# EAGLE design aspirin (EAGLE 6.1)
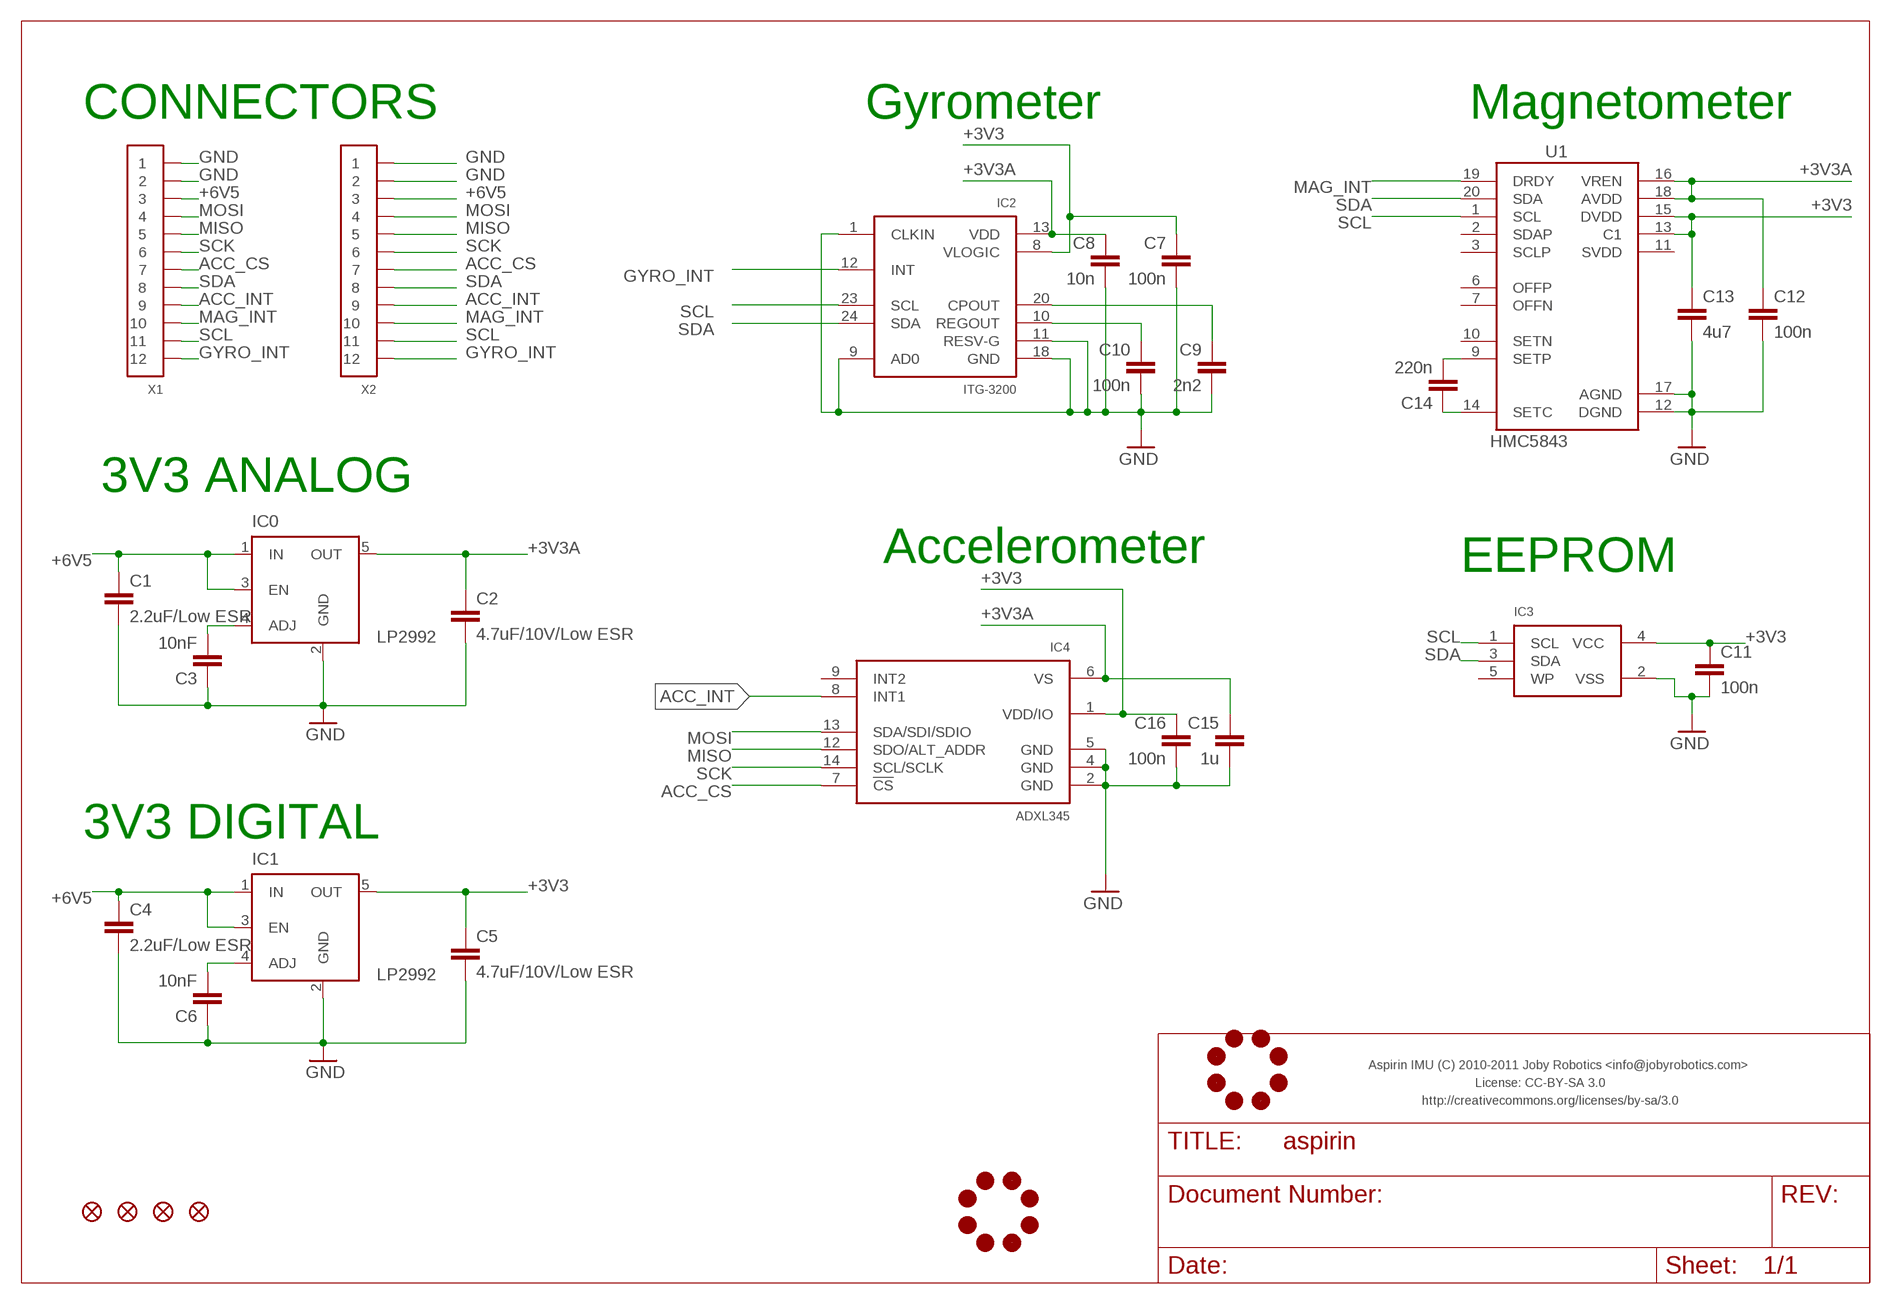
[diagram p0: schematic, sheet 1]

## Parts
C1  2.2uF/Low ESR  CAPACITOR-0603  [0603-CAP]
C2  4.7uF/10V/Low ESR  CAPACITOR-0603  [0603-CAP]
C3  10nF  CAPACITOR-0603  [0603-CAP]
C4  2.2uF/Low ESR  CAPACITOR-0603  [0603-CAP]
C5  4.7uF/10V/Low ESR  CAPACITOR-0603  [0603-CAP]
C6  10nF  CAPACITOR-0603  [0603-CAP]
C7  100n  CAPACITOR-0603  [0603-CAP]
C8  10n  CAPACITOR-0603  [0603-CAP]
C9  2n2  CAPACITOR-0603  [0603-CAP]
C10  100n  CAPACITOR-0603  [0603-CAP]
C11  100n  CAPACITOR-0603  [0603-CAP]
C12  100n  CAPACITOR-0603  [0603-CAP]
C13  4u7  CAPACITOR-0603  [0603-CAP]
C14  220n  CAPACITOR-0603  [0603-CAP]
C15  1u  CAPACITOR-0603  [0603-CAP]
C16  100n  CAPACITOR-0603  [0603-CAP]
IC0  LP2992  MIC5219BM5  [SOT23-5]
IC1  LP2992  MIC5219BM5  [SOT23-5]
IC2  ITG-3200  ITG-3200-AX  [QFN24-WITH-AXES]
IC3  I2C_EEPROM-SOT23-5  [SOT23-5]
IC4  ADXL345  [LGA-14]
JL1  JOBY_LOGO-6MIL  [JOBY_LOGO_6MIL]
JL2  JOBY_LOGO-6MIL  [JOBY_LOGO_6MIL]
JP1  FIDUCIAL1X2  [FIDUCIAL-1X2]
JP2  FIDUCIAL1X2  [FIDUCIAL-1X2]
JP3  FIDUCIAL1X2  [FIDUCIAL-1X2]
JP4  FIDUCIAL1X2  [FIDUCIAL-1X2]
U1  HMC5843  [LPCC20-HMC5843]
X1  CONN_12-1-53047  [PB-53047-12]
X2  CONN_12-1-53261  [PB-53261-12]

## Nets
+3V3: C5.P$1 C7.P$1 C11.P$1 C13.P$1 C16.P$1 IC1.5(OUT) IC2.8(VLOGIC) IC3.4(VCC) IC4.1(VDD/IO) U1.13(C1) U1.15(DVDD)
+3V3A: C2.P$1 C8.P$1 C12.P$1 C15.P$1 IC0.5(OUT) IC2.13(VDD) IC4.6(VS) U1.16(VREN) U1.18(AVDD)
+6V5: C1.P$1 C4.P$1 IC0.1(IN) IC0.3(EN) IC1.1(IN) IC1.3(EN) X1.3 X2.3
ACC_CS: IC4.7(!CS) X1.7 X2.7
ACC_INT: IC4.8(INT1) X1.9 X2.9
GND: C1.P$2 C2.P$2 C3.P$1 C4.P$2 C5.P$2 C6.P$1 C7.P$2 C8.P$2 C9.P$2 C10.P$2 C11.P$2 C12.P$2 C13.P$2 C15.P$2 C16.P$2 IC0.2(GND) IC1.2(GND) IC2.1(CLKIN) IC2.9(AD0) IC2.11(RESV-G) IC2.18(GND) IC3.2(VSS) IC4.2(GND) IC4.4(GND) IC4.5(GND) U1.12(DGND) U1.17(AGND) X1.1 X1.2 X2.1 X2.2
GYRO_INT: IC2.12(INT) X1.12 X2.12
MAG_INT: U1.19(DRDY) X1.10 X2.10
MISO: IC4.12(SDO/ALT_ADDR) X1.5 X2.5
MOSI: IC4.13(SDA/SDI/SDIO) X1.4 X2.4
N$1: C9.P$1 IC2.20(CPOUT)
N$2: C10.P$1 IC2.10(REGOUT)
N$19: C6.P$2 IC1.4(ADJ)
N$23: C3.P$2 IC0.4(ADJ)
N$34: C14.P$2 U1.9(SETP)
N$48: C14.P$1 U1.14(SETC)
SCK: IC4.14(SCL/SCLK) X1.6 X2.6
SCL: IC2.23(SCL) IC3.1(SCL) U1.1(SCL) X1.11 X2.11
SDA: IC2.24(SDA) IC3.3(SDA) U1.20(SDA) X1.8 X2.8
Unconnected: IC3.5(WP) IC4.9(INT2) U1.2(SDAP) U1.3(SCLP) U1.6(OFFP) U1.7(OFFN) U1.10(SETN) U1.11(SVDD)

## Notes on the sheet
- CONNECTORS | Gyrometer | Magnetometer
- 3V3 ANALOG
- Accelerometer | EEPROM
- 3V3 DIGITAL
- Aspirin IMU (C) 2010-2011 Joby Robotics <info@jobyrobotics.com>
- License: CC-BY-SA 3.0
- http://creativecommons.org/licenses/by-sa/3.0

## Library data of the parts
C1-C16 = pel_dipol_comp:CAPACITOR
IC0 IC1 = v-reg-micrel:MIC5219BM5: VOLTAGE REGULATOR
IC2 = aspirin:ITG-3200
IC3 = aspirin:I2C_EEPROM
IC4 = aspirin:ADXL345
JL1 JL2 = aspirin:JOBY_LOGO
JP1-JP4 = aspirin:FIDUCIAL: Fiducial Alignment Points Various fiducial points for machine vision alignment.
U1 = aspirin:HMC5843: Honeywell HMC5843 - 3-Axis Digital Magnetometer - 3-Axis Magnetoresistive Sensors and ASIC in a Single Package - Low Voltage Operations (2.5 to 3.3V) - I2C Interface
X1 X2 = pel_molex:CONN_12-1

## Board
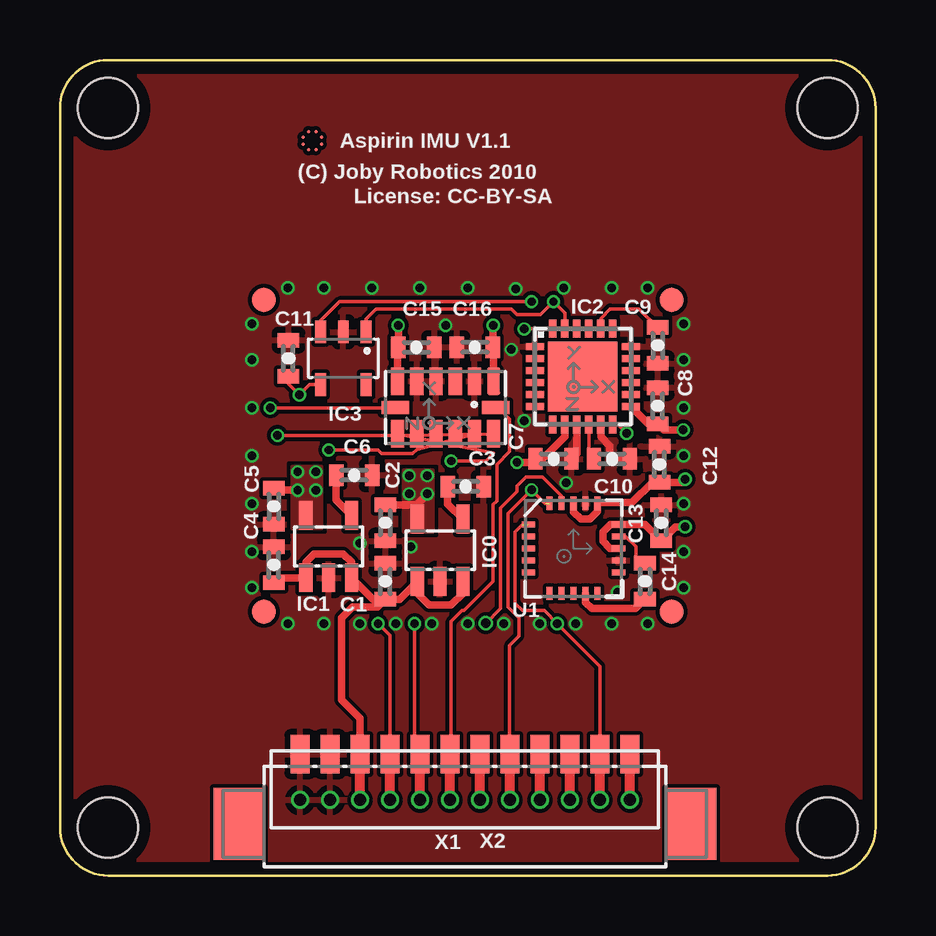
[diagram p1: board, top side]
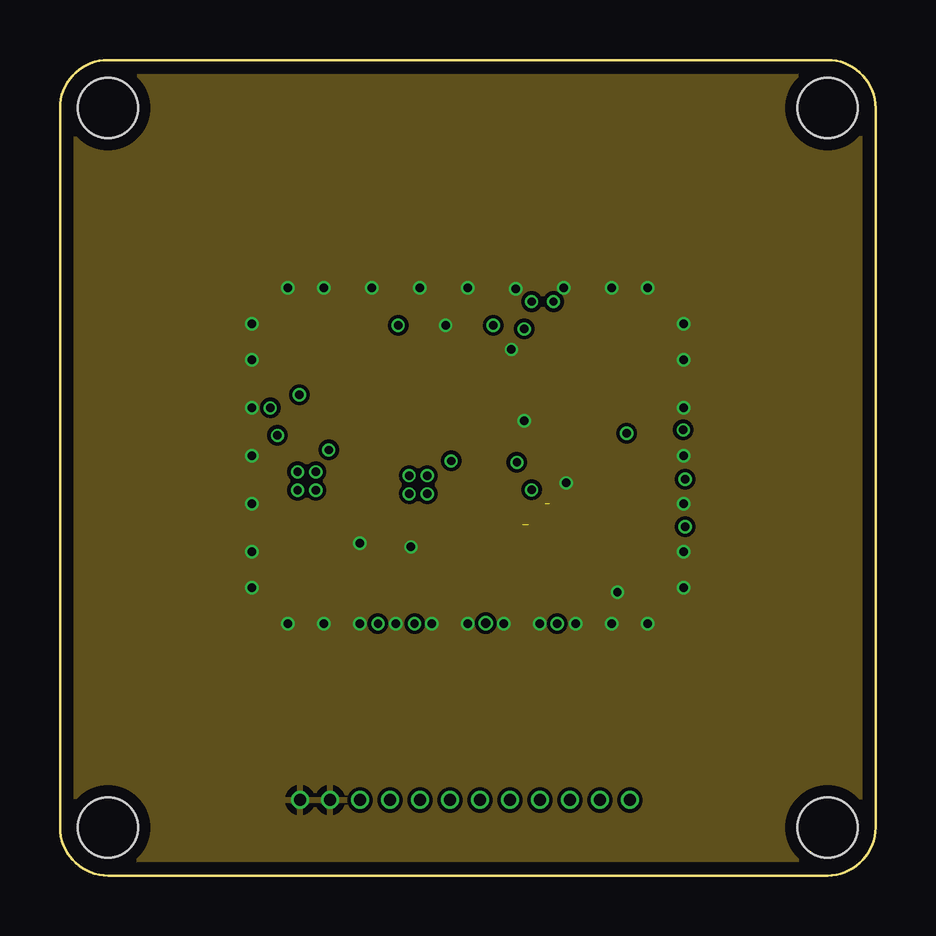
[diagram p2: board, inner layer Route2]
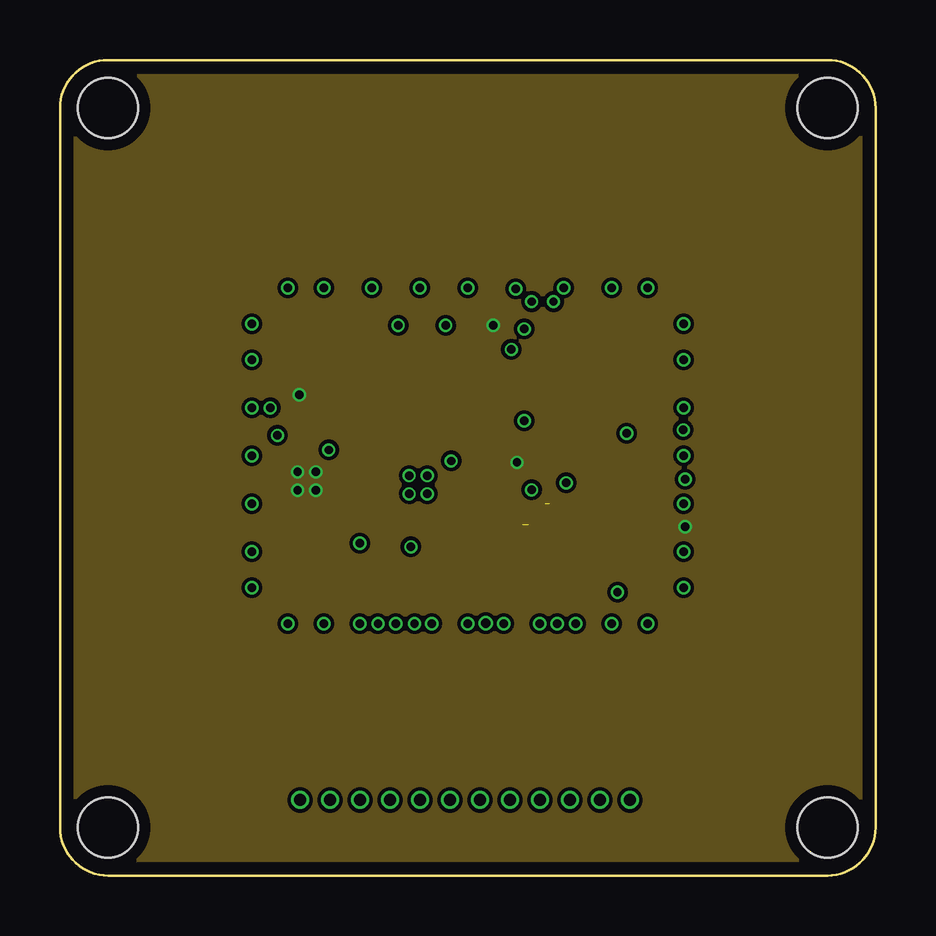
[diagram p3: board, inner layer Route15]
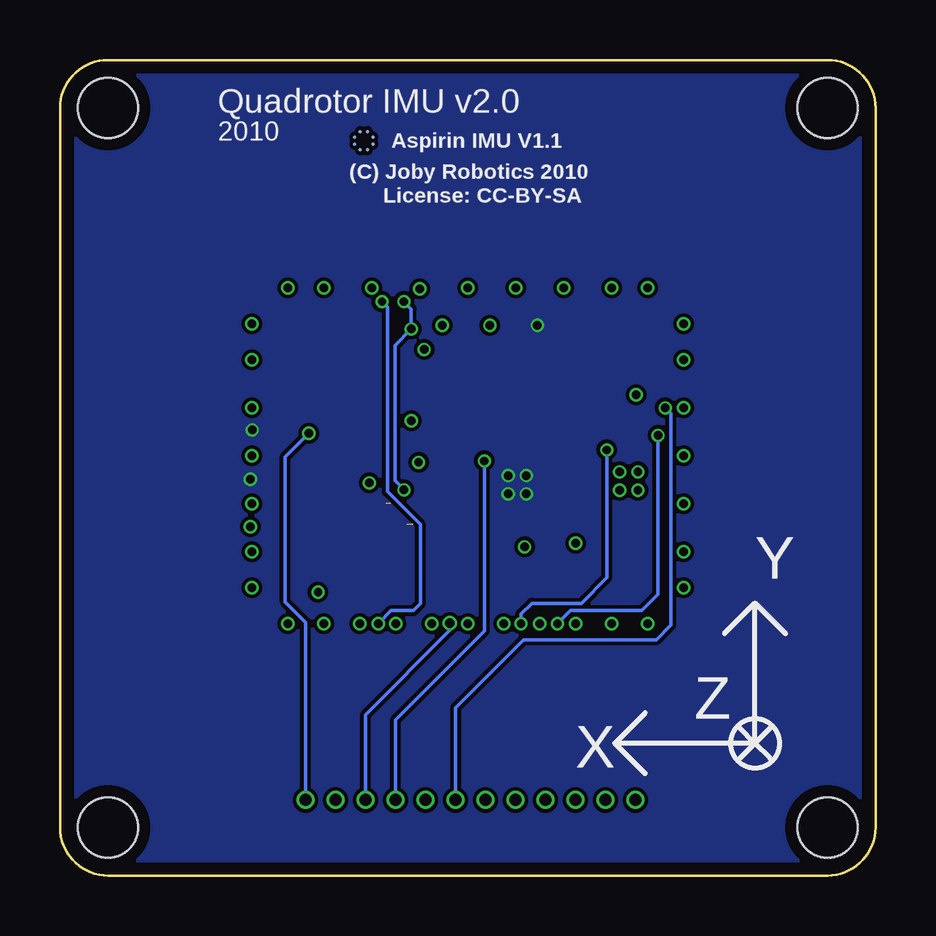
[diagram p4: board, bottom side, seen from below]

Size 34 x 34 mm. Coordinates in mm from the lower left corner, seen from the top.
Outline: 2,34 32,34 arc-90 34,32 34,2 arc-90 32,0 2,0 arc-90 0,2 0,32 arc-90 2,34
Copper layers (1*2+15*16): Top 0.035mm / dielectric 0.2mm / Route2 0.035mm / dielectric 1.5mm / Route15 0.035mm / dielectric 0.2mm / Bottom 0.035mm
Design rules: minimum track width 0.15mm, minimum drill 0.35mm, track to track 6mil, track to pad 6mil, pad to pad 6mil, via to via 6mil, smd to smd 6mil, copper to edge 20mil, drill to drill 8mil, minimum pad ring 0.1mm, minimum via ring 0.1mm, stop-mask expansion 4mil, vias tented up to drill 0mil, thermal gap 10mil
Holes 2.5 mm at 2,32 32,32 32,2 2,2

### Footprints (pad centres in the part's own frame; a part is rotated, then mirrored left to right if it is on the bottom)
0603-CAP = smd 0.6 x 0.9: P$1 -0.75,0; P$2 0.75,0
SOT23-5 = smd 0.55 x 1.2: 1 -0.95,-1.3; 2 0,-1.3; 3 0.95,-1.3; 4 0.95,1.3; 5 -0.95,1.3
QFN24-WITH-AXES = smd 0.75 x 0.3: 1 -2,1.25; 2 -2,0.75; 3 -2,0.25; 4 -2,-0.25; 5 -2,-0.75; 6 -2,-1.25; 13 2,-1.25; 14 2,-0.75; 15 2,-0.25; 16 2,0.25; 17 2,0.75; 18 2,1.25 | smd 0.3 x 0.75: 7 -1.25,-2; 8 -0.75,-2; 9 -0.25,-2; 10 0.25,-2; 11 0.75,-2; 12 1.25,-2; 19 1.25,2; 20 0.75,2; 21 0.25,2; 22 -0.25,2; 23 -0.75,2; 24 -1.25,2 | smd 2.9 x 2.9: EXP 0,0
SOT23-5' = smd 0.45 x 0.95: 1 0.95,1.1; 2 0,1.1; 3 -0.95,1.1; 4 -0.95,-1.1; 5 0.95,-1.1
LGA-14 = smd 1.145 x 0.55: 1 -1.097,2; 2 -1.097,1.2; 3 -1.097,0.4; 4 -1.097,-0.4; 5 -1.097,-1.2; 6 -1.097,-2; 8 1.097,-2; 9 1.097,-1.2; 10 1.097,-0.4; 11 1.097,0.4; 12 1.097,1.2; 13 1.097,2 | smd 0.55 x 1.145: 7 0,-2.098; 14 0,2.098
JOBY_LOGO_6MIL = smd 0.152 x 0.152: 1 -0.152,0.381; 2 0.152,0.381; 3 0.381,0.152; 4 0.381,-0.152; 5 0.152,-0.381; 6 -0.152,-0.381; 7 -0.381,-0.152; 8 -0.381,0.152
FIDUCIAL-1X2 = smd 1 x 1: 1 0,0
LPCC20-HMC5843 = smd 0.25 x 0.56: 1 1,1.88; 2 0.5,1.88; 3 0,1.88; 4 -0.5,1.88; 5 -1,1.88; 11 -1,-1.88; 12 -0.5,-1.88; 13 0,-1.88; 14 0.5,-1.88; 15 1,-1.88 | smd 0.56 x 0.25: 6 -1.88,1; 7 -1.88,0.5; 8 -1.88,0; 9 -1.88,-0.5; 10 -1.88,-1; 16 1.88,-1; 17 1.88,-0.5; 18 1.88,0; 19 1.88,0.5; 20 1.88,1
PB-53047-12 = drill 0.5: 1 -6.875,0; 2 -5.625,0; 3 -4.375,0; 4 -3.125,0; 5 -1.875,0; 6 -0.625,0; 7 0.625,0; 8 1.875,0; 9 3.125,0; 10 4.375,0; 11 5.625,0; 12 6.875,0
PB-53261-12 = smd 0.8 x 1.6: 1 -6.875,1.1; 2 -5.625,1.1; 3 -4.375,1.1; 4 -3.125,1.1; 5 -1.875,1.1; 6 -0.625,1.1; 7 0.625,1.1; 8 1.875,1.1; 9 3.125,1.1; 10 4.375,1.1; 11 5.625,1.1; 12 6.875,1.1 | smd 2.1 x 3: MNT1 -9.425,-1.8; MNT2 9.425,-1.8

### Placement (x,y rotation side)
C1  13.56,12.27 90 top
C2  13.56,14.71 270 top
C3  16.92,16.22 180 top
C4  8.92,12.95 90 top
C5  8.92,15.39 270 top
C6  12.27,16.69 180 top
C7  20.57,17.37 0 top
C8  24.92,19.58 90 top
C9  24.92,22.1 270 top
C10  23.01,17.37 0 top
C11  9.53,21.56 90 top
C12  24.99,17.14 90 top
C13  25.07,14.71 90 top
C14  24.38,12.27 270 top
C15  14.86,22.02 0 top
C16  17.3,22.02 180 top
IC0  15.85,13.56 0 top
IC1  11.2,13.72 0 top
IC2  21.79,20.8 0 top
IC3  [SOT23-5']  11.81,21.56 0 top
IC4  16.08,19.51 270 top
JL1  21.34,30.63 0 bottom
JL2  10.52,30.63 0 top
JP1  8.5,24 0 top
JP2  25.5,24 0 top
JP3  8.5,11 0 top
JP4  25.5,11 0 top
U1  21.41,13.64 90 top
X1  16.88,3.15 0 top
X2  16.88,3.96 0 top

### Tracks (layer width: path | path; a pad name or v marks a point on that pad's centre or on a via)
+3V3  (via drill 0.35)
  Top 0.152: C11.P$1 9.53,20.5 v9.98,20.04 10.41,20.46 IC3.4
  Top 0.305: 23.28,13.64 U1.13 22.94,13.64 22.63,13.95 22.63,14.33 22.95,14.64 U1.15 | C5.P$1 8.99,16.06 v9.91,16.06 | v18.06,22.94 18.05,22.92 C16.P$1 18.08,21.99 IC4.1 | U1.15 | v26.06,14.54 25.65,14.54 C13.P$1 24.39,14.64 U1.15 | IC2.8 21.04,18.3 21.03,18.29 20.12,17.37 C7.P$1 19.67,17.22 v19.05,17.22
  other vias: 10.67,16.06 9.91,16.83 10.67,16.83
  pour Route15: 0,0 33.97,0 33.97,33.97 0,33.97
  pour Top (no thermals): 10.9,14.46 9.68,14.46 9.68,17.05 10.9,17.05
+3V3A  (via drill 0.35)
  Top 0.305: U1.18 21.41,15.16 21.72,14.86 22.1,14.86 22.41,15.17 U1.16 22.44,15.54 23.85,15.54 24.7,16.39 C12.P$1 25.93,16.39 v26.06,16.52 | C2.P$1 14.86,15.46 v15.32,15.91 | v14.1,22.94 14.11,22.92 C15.P$1 14.08,21.99 IC4.6 | C8.P$1 24.88,18.87 | C8.P$1 25.17,18.58 v25.98,18.58 | IC2.13 24.51,18.83 C8.P$1
  other vias: 14.55,15.91 15.32,16.67 14.55,16.67
  pour Bottom: 34,0 34,34 0,34 0,0
  pour Top (no thermals): 15.54,14.33 14.33,14.33 14.33,16.92 15.54,16.92
+6V5
  Top 0.305: C4.P$1 9.13,12.42 IC1.1 10.25,13.07 10.59,13.41 11.81,13.41 12.15,13.07 IC1.3 13.05,11.52 C1.P$1 | C1.P$1 14.15,11.52 IC0.1 14.9,11.77 15.39,11.28 16.31,11.28 16.8,11.77 IC0.3 | C1.P$1 13.25,11.2 12.19,11.2 11.73,10.74 11.73,7.32 12.51,6.54 X2.3
  Top 0.406: X1.3 X2.3
ACC_CS  (via drill 0.35)
  Top 0.152: IC4.7 13.97,19.49 v8.76,19.49
  Top 0.406: X1.7 X2.7
  Bottom 0.152: X1.7 17.51,7 14.69,9.81 14.67,9.83 9.14,9.83 8.53,10.44 8.53,19.26 v8.76,19.49
ACC_INT  (via drill 0.35)
  Top 0.152: IC4.8 18.08,17.61 17.75,17.28 v16.31,17.28
  Top 0.406: X1.9 X2.9
  Bottom 0.152: v16.31,17.28 16.31,10.2 20.01,6.5 X1.9
GND  (via drill 0.35)
  Top 0.254: 23.77,17.28 23.62,17.43
  Top 0.305: C7.P$2 21.54,17.59 IC2.9 | IC2.11 22.54,18.3 22.94,17.91 22.94,17.37 C10.P$2
  other vias: 12.5,13.85 14.63,13.7 26,19.5 26,21.5 26,23 26,17.5 26,15.5 26,13.5 26,12 9.5,10.5 11,10.5 8,13.5 8,15.5 8,17.5 8,19.5 8,21.5 9.5,24.5 11,24.5 13,24.5 15,24.5 17,24.5 19,24.46 24.5,24.5 21,24.5 23,24.5 16.08,22.94 8,23 8,12 19.35,18.96 18.82,21.93 21.11,16.37 23.24,11.81 12.5,10.5 14,10.5 15.5,10.5 17,10.5 18.5,10.5 20,10.5 21.5,10.5 23,10.5 24.5,10.5
  pour Top (rank 6): 0,0 33.97,0 33.97,33.97 0,33.97
  pour Route2: 0,0 33.97,0 33.97,33.97 0,33.97
GYRO_INT  (via drill 0.35)
  Top 0.152: v23.62,18.44 23.26,18.8 IC2.12
  Top 0.406: X1.12 X2.12
  Bottom 0.152: v23.62,18.44 24.61,17.45 24.61,11.41 23.76,10.56 X1.12
MAG_INT  (via drill 0.4)
  Top 0.152: X2.10 | U1.19 20.91,15.82 20.12,16.61 19.43,16.61 19.05,16.23 19.05,16 18.36,15.32 18.36,11.12 v17.75,10.52
  Top 0.406: X1.10 X2.10
  Bottom 0.152: v17.75,10.52 17.75,10.21 21.26,6.71 X1.10
MISO  (via drill 0.35)
  Top 0.152: IC4.12 14.88,17.76 14.71,17.59 13.41,17.59 13.26,17.74 v11.2,17.74 | X2.5 14.78,5.29 v14.78,10.5
  Top 0.406: X1.5 X2.5
  Bottom 0.152: v11.2,17.74 11.2,12.42 12.27,11.35 14.33,11.35 14.78,10.9 v14.78,10.5
MOSI  (via drill 0.35)
  Top 0.152: 13.79,5.1 X2.4 13.76,10 v13.26,10.5 | IC4.13 14.02,18.35 v9.07,18.35
  Top 0.406: X1.4 X2.4
  Bottom 0.152: v9.07,18.35 9.07,11.72 9.74,11.05 12.72,11.05 13.26,10.52 v13.26,10.5
N$1
  Top 0.152: IC2.20 22.54,23.23 22.94,23.62 24.14,23.62 C9.P$1
N$2
  Top 0.152: IC2.10 22.04,17.37 C10.P$1
N$19
  Top 0.305: C6.P$2 11.52,15.65 IC1.4
N$23
  Top 0.305: C3.P$2 16.17,15.5 IC0.4
N$34
  Top 0.305: U1.9 21.91,11.39 22.17,11.12 23.99,11.12 C14.P$2
N$48
  Top 0.152: U1.14 23.58,14.14 24,13.72 24,13.02 C14.P$1
SCK
  Top 0.152: 16.31,5.11 X2.6 16.31,5.11 | IC4.14 18.27,19.51 18.75,19.04 18.75,17.68 18.21,17.14 18.21,15.62 18.06,15.47 18.06,12.27 16.84,11.05 16.76,11.05 16.31,10.59 16.31,10.52 16.31,5.11
  Top 0.406: X1.6 X2.6
SCL  (via drill 0.35)  (1 unrouted)
  Top 0.152: IC3.1 12.76,23.2 13.18,23.62 18.82,23.62 19.05,23.39 20.04,23.39 v20.57,23.93 21.04,23.46 IC2.23 | 19.29,14.64 18.97,14.33 18.97,11.41 18.97,11.35 19.28,11.05 20.19,11.05 20.73,10.52 v20.73,10.5 22.51,8.72 X1.11
  Top 0.406: X1.11 X2.11
  Bottom 0.152: v20.57,23.93 20.34,23.7 20.34,23.24 20.34,16 18.97,14.63 18.97,11.34 19.26,11.05 20.19,11.05 20.73,10.52 v20.73,10.5
SDA  (via drill 0.35)  (1 unrouted)
  Top 0.152: X2.8 18.75,5.07 | v19.66,23.93 11.66,23.93 10.86,23.13 IC3.3 | 20.22,15.52 v19.66,16.08 18.67,15.09 18.67,11.2 19.13,10.74 19.13,9.98 18.75,9.6 18.75,5.07 | X2.8 18.67,5.15 | X2.8 18.75,5.07 | IC2.24 19.37,22.8 v19.36,22.78
  Top 0.406: X1.8 X2.8
  Bottom 0.152: v19.66,23.93 19.36,23.62 v19.36,22.78 20.04,22.1 20.04,16.46 v19.66,16.08

### Text on the board
tPlace: Aspirin IMU V1.1 | (C) Joby Robotics 2010 | License: CC-BY-SA
bPlace: Aspirin IMU V1.1 | (C) Joby Robotics 2010 | License: CC-BY-SA
bNames: Quadrotor IMU v2.0 | 2010 | Y | Z | X